# Altium schematic sheet 01_Block_Diagram.SchDoc
size A4; Date: 19/03/2023; CheckedBy: YenDoo; DrawnBy: Hnit; DocumentNumber: 01; Revision: 01; SheetNumber: 1; SheetTotal: 3; Time: 00:00:00
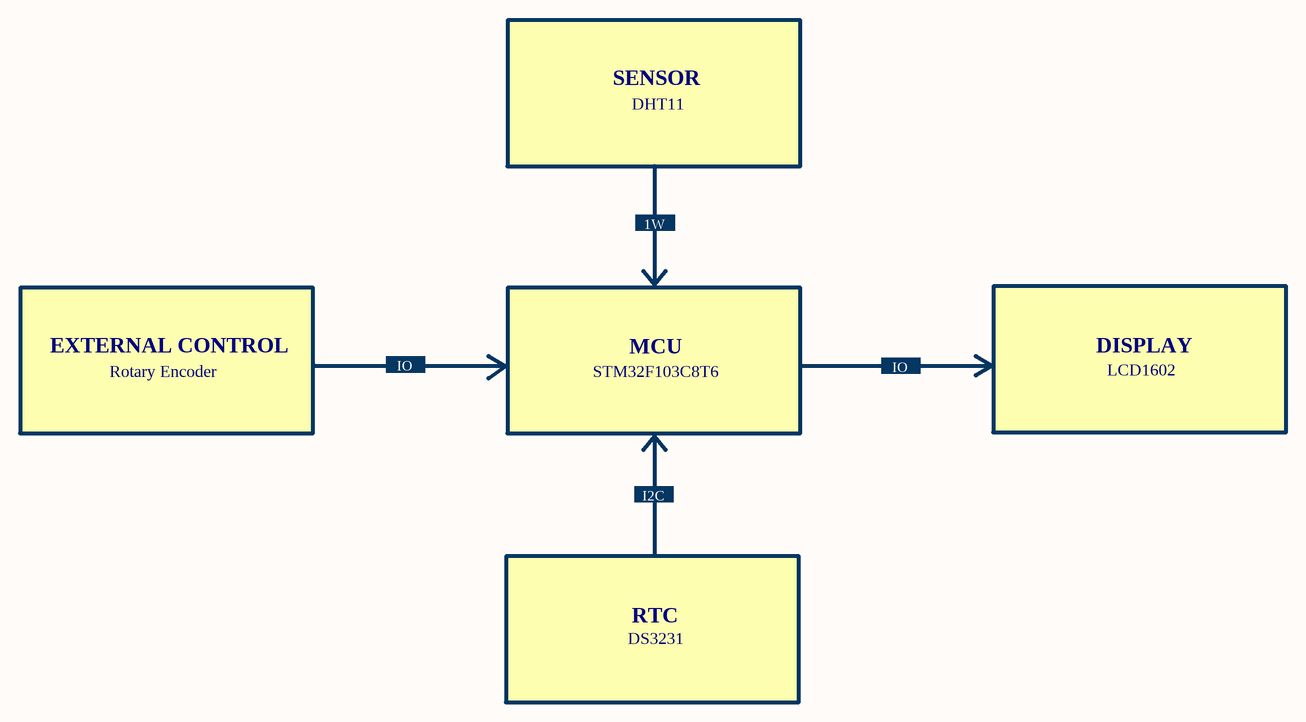
[diagram p0: 01_Block_Diagram.SchDoc]

## Notes on the sheet
- SENSOR
- DHT11
- 1W
- EXTERNAL CONTROL
- Rotary Encoder
- IO
- STM32F103C8T6
- MCU
- DISPLAY
- LCD1602
- I2C
- DS3231
- RTC
- Title
- Size
- Number
- Revision
- Date
- Draw by:
- A4
- Check by:
- Time
- File: